# EAGLE design pgacontrol-mini (EAGLE 7.2.0)
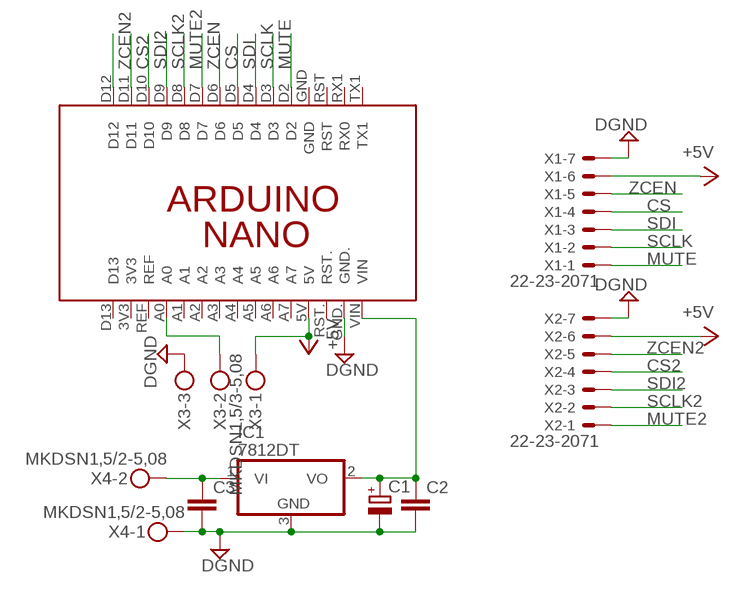
[diagram p0: schematic, sheet 1]

## Parts
C1  CPOL-EUSMCD  [SMC_D]
C2  C-EUC1206  [C1206]
C3  C-EUC1206  [C1206]
IC1  7812DT  [TO252]
PCB1  ARDUINO_NANO  [ARDUINO_NANO]
X1  22-23-2071  [22-23-2071]
X2  22-23-2071  [22-23-2071]
X3  MKDSN1,5/3-5,08  [MKDSN1,5/3-5,08]
X4  MKDSN1,5/2-5,08  [MKDSN1,5/2-5,08]

## Nets
+5V: PCB1.5V X1.6 X2.6 X3.1
CS: PCB1.D5 X1.4
CS2: PCB1.D10 X2.4
DGND: C1.- C2.2 C3.2 IC1.3(GND) PCB1.GND. X1.7 X2.7 X3.3 X4.1
MUTE: PCB1.D2 X1.1
MUTE2: PCB1.D7 X2.1
N$3: PCB1.A0 X3.2
N$10: PCB1.D12
SCLK: PCB1.D3 X1.2
SCLK2: PCB1.D8 X2.2
SDI: PCB1.D4 X1.3
SDI2: PCB1.D9 X2.3
VI: C3.1 IC1.1(VI) X4.2
VO: C1.+ C2.1 IC1.2(VO) PCB1.VIN
ZCEN: PCB1.D6 X1.5
ZCEN2: PCB1.D11 X2.5
Unconnected: PCB1.3V3 PCB1.A1 PCB1.A2 PCB1.A3 PCB1.A4 PCB1.A5 PCB1.A6 PCB1.A7 PCB1.D13 PCB1.GND PCB1.REF PCB1.RST PCB1.RST. PCB1.RX1(RX0) PCB1.TX1

## Library data of the parts
C1 = Vwvwbg:CPOL-EU: POLARIZED CAPACITOR, European symbol
C2 C3 = Vwvwbg:C-EU: CAPACITOR, European symbol
IC1 = adafruit:78*: Positive VOLTAGE REGULATOR Added bigger pads to the TO-92 package
PCB1 = E14_Arduino_revB:ARDUINO_NANO: Device for representing an Arduino Nano board with a footprint in an EAGLE design. Created by Dave Young for Element14. More EAGLE documentation at: http://www.element14.com/community/community/knode/cadsoft_eagle
X1 X2 = con-molex:22-23-2071: .100" (2.54mm) Center Header - 7 Pin; MF: MOLEX; MPN: 22-23-2071; OC_FARNELL: 1654534; OC_NEWARK: 56H0445
X3 = con-phoenix-508:MKDSN1,5/3-5,08: MKDSN 1,5/ 3-5,08 Printklemme Nennstrom: 13,5 A Nennspannung: 250 V Rastermaß: 5,08 mm Polzahl: 3 Anschlussart: Schraubanschluss Montage: Löten Anschlussrichtung Leiter/Platine: 0 ° Artikelnummer: 1729131 Source: http://eshop.phoenixcontact.com .. 1729131.pdf
X4 = con-phoenix-508:MKDSN1,5/2-5,08: MKDSN 1,5/ 2-5,08 Printklemme Nennstrom: 13,5 A Nennspannung: 250 V Rastermaß: 5,08 mm Polzahl: 2 Anschlussart: Schraubanschluss Montage: Löten Anschlussrichtung Leiter/Platine: 0 ° Artikelnummer: 1729128 Source: http://eshop.phoenixcontact.com .. 1729128.pdf

## Board
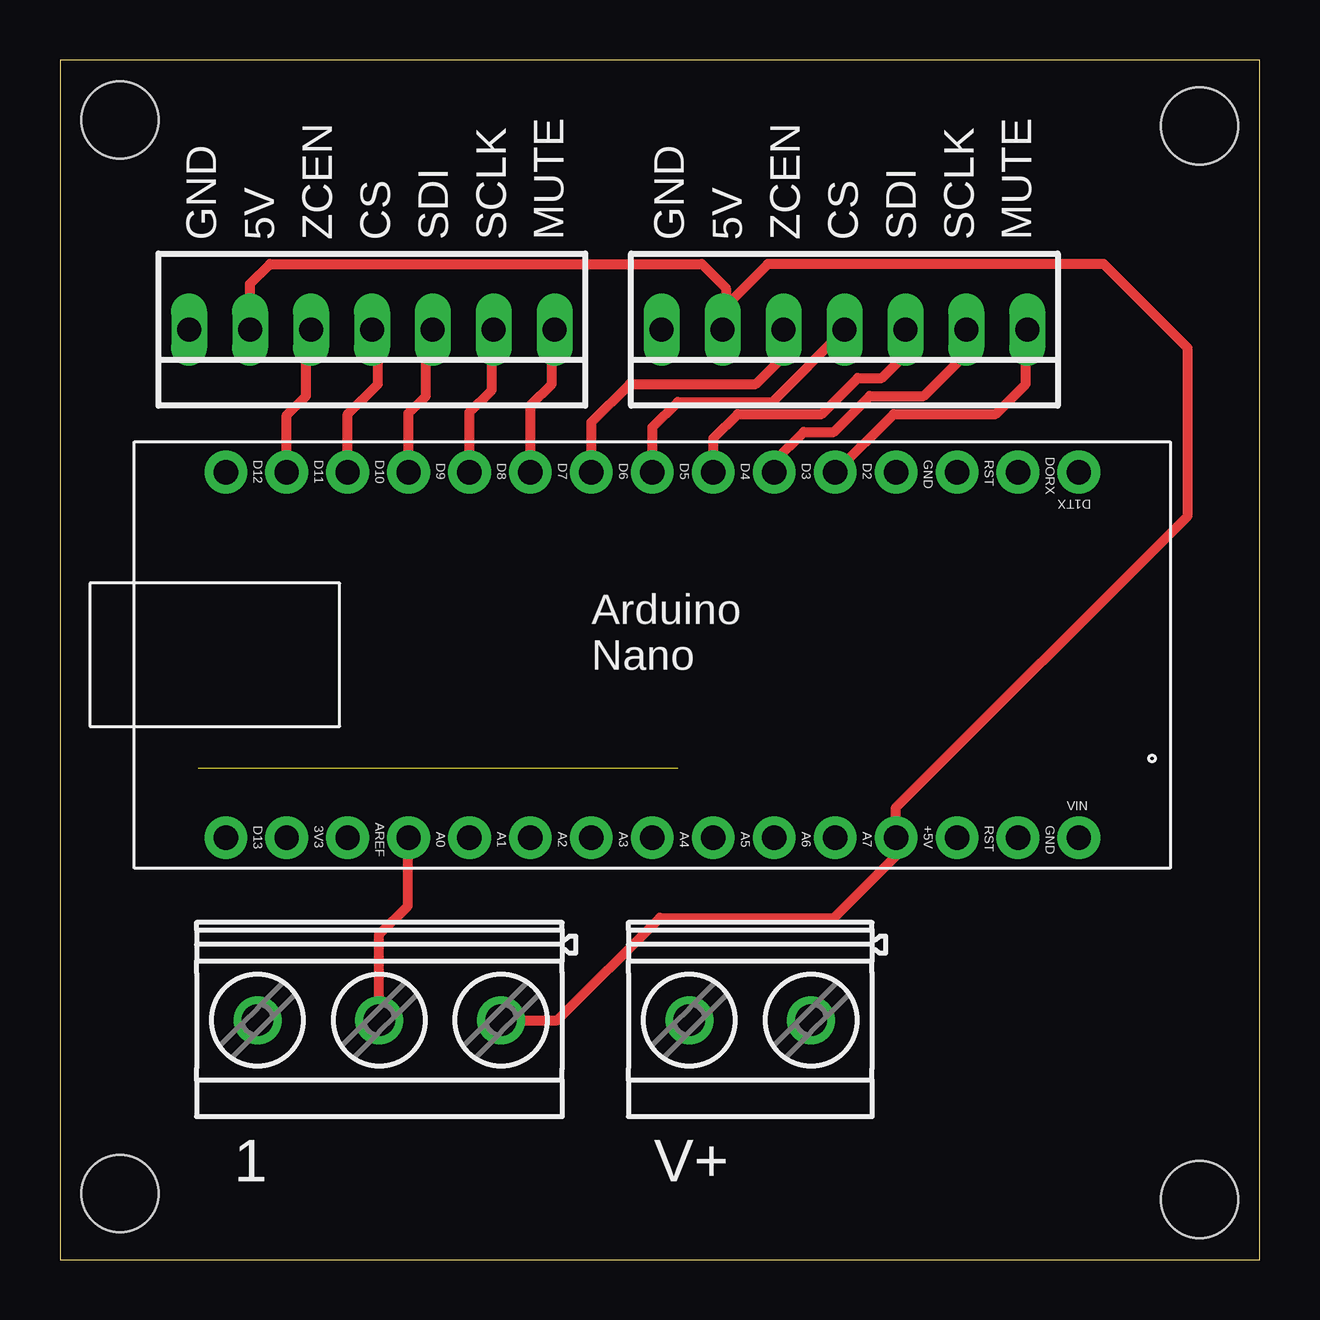
[diagram p1: board, top side]
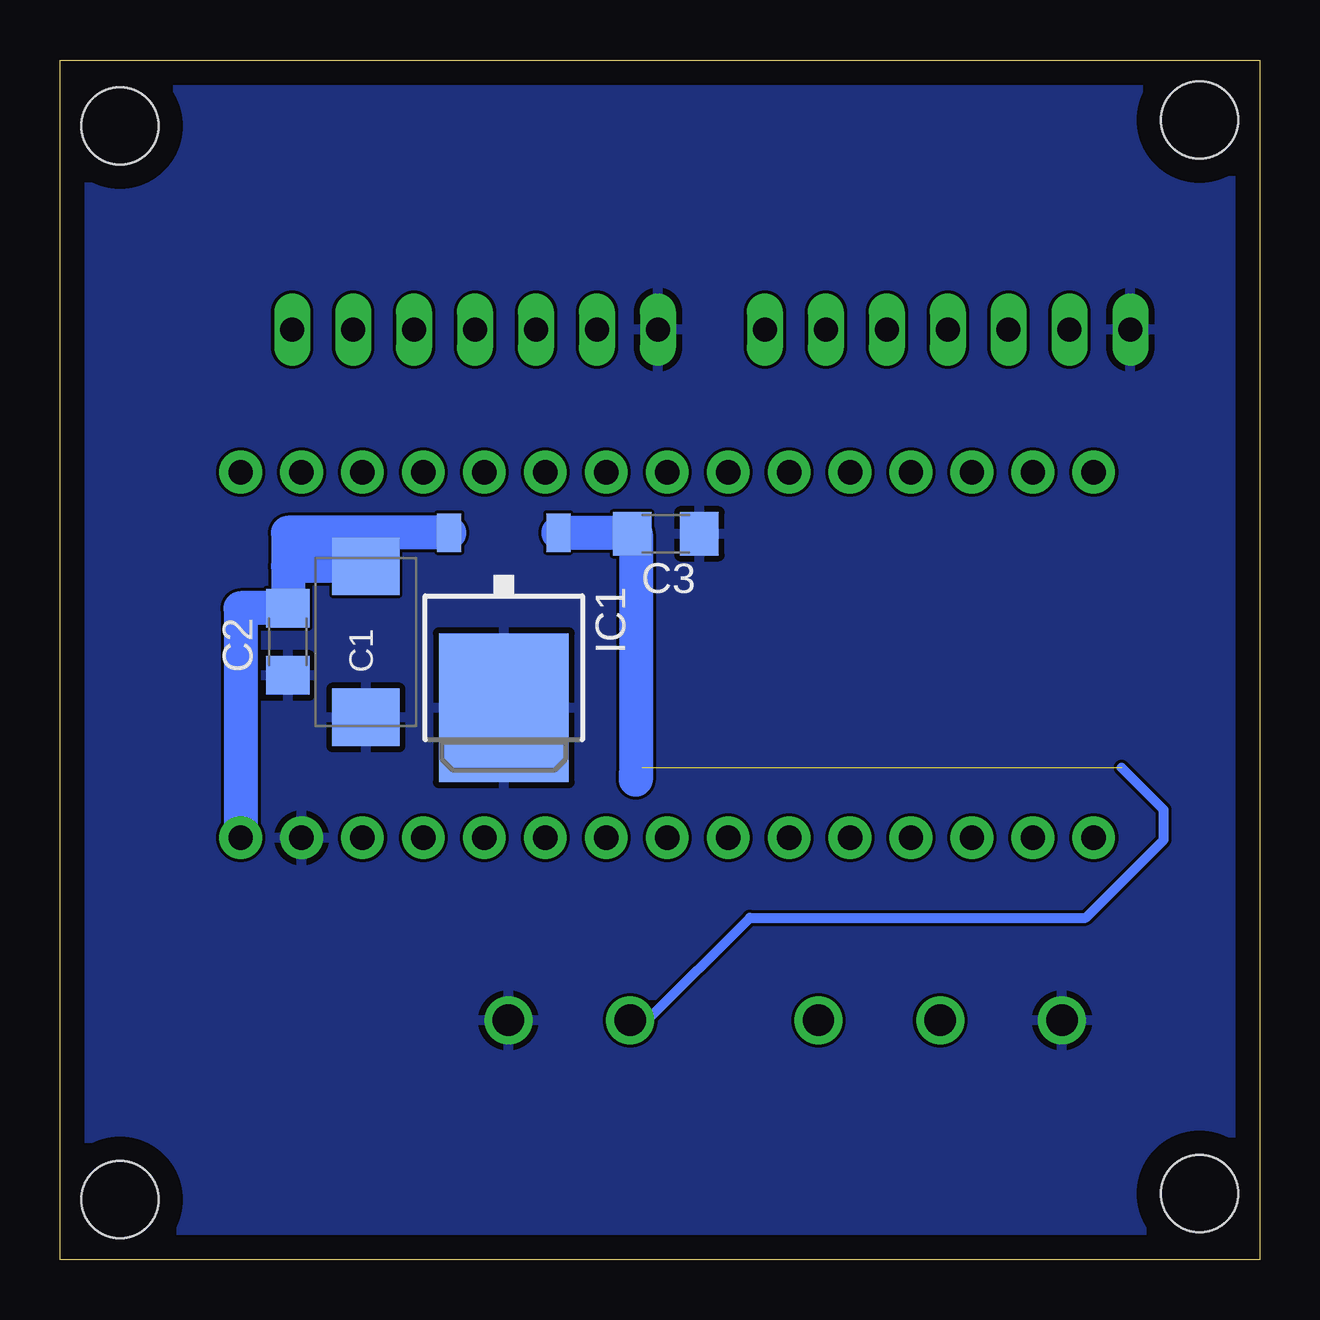
[diagram p2: board, bottom side, seen from below]

Size 50 x 50 mm. Coordinates in mm from the lower left corner, seen from the top.
Outline: 0,0 50,0 50,50 0,50 0,0
Copper layers (1*16): Top 0.035mm / dielectric 1.5mm / Bottom 0.035mm
Design rules "default *": minimum track width 10mil, minimum drill 12mil, track to track 5mil, track to pad 5mil, pad to pad 5mil, via to via 5mil, smd to smd 5mil, copper to edge 40mil, drill to drill 8mil, minimum pad ring 10mil, minimum via ring 8mil, stop-mask expansion 4mil, vias tented up to drill 0mil, thermal gap 10mil
Holes 3.2 mm at 47.5,97.75 2.75,97.5 2.5,47.5 2.5,2.75 47.5,2.5 47.5,47.25

### Footprints (pad centres in the part's own frame; a part is rotated, then mirrored left to right if it is on the bottom)
SMC_D = smd 2.4 x 2.8: + -3.15,0; - 3.15,0
C1206 = smd 1.6 x 1.8: 1 -1.4,0; 2 1.4,0
TO252 = smd 1 x 1.6: 1 -2.28,-4.8; 2 2.28,-4.8 | smd 5.4 x 6.2: 3 0,2.5
ARDUINO_NANO = drill 1.016 pad 1.778: 3V3 6.35,1.27; 5V 31.75,1.27; A0 11.43,1.27; A1 13.97,1.27; A2 16.51,1.27; A3 19.05,1.27; A4 21.59,1.27; A5 24.13,1.27; A6 26.67,1.27; A7 29.21,1.27; D2 29.21,16.51; D3 26.67,16.51; D4 24.13,16.51; D5 21.59,16.51; D6 19.05,16.51; D7 16.51,16.51; D8 13.97,16.51; D9 11.43,16.51; D10 8.89,16.51; D11 6.35,16.51; D12 3.81,16.51; D13 3.81,1.27; GND 31.75,16.51; GND. 36.83,1.27; REF 8.89,1.27; RST 34.29,16.51; RST. 34.29,1.27; RX1 36.83,16.51; TX1 39.37,16.51; VIN 39.37,1.27
22-23-2071 = drill 1 long: 1 -7.62,0; 2 -5.08,0; 3 -2.54,0; 4 0,0; 5 2.54,0; 6 5.08,0; 7 7.62,0
MKDSN1,5/3-5,08 = drill 1.3 pad 2: 1 -7.641,0.025; 2 -2.561,0.025; 3 2.519,0.025
MKDSN1,5/2-5,08 = drill 1.3 pad 2: 1 -2.561,0.025; 2 2.519,0.025

### Placement (x,y rotation side)
C1  37.25,25.75 270 bottom
C2  40.5,25.75 270 bottom
C3  24.75,30.25 0 bottom
IC1  31.5,25.5 180 bottom
PCB1  3.1,16.31 0 top
X1  32.7,38.76 180 top
X2  13,38.76 180 top
X3  10.75,10 180 top
X4  28.75,10 180 top

### Tracks (layer width: path | path; a pad name or v marks a point on that pad's centre or on a via)
+5V
  Top 0.406: X3.1 20.73,9.97 25,14.25 32.25,14.25 35,17 35,17.43 PCB1.5V 34.85,18.85 47,31 47,38 43.5,41.5 29.5,41.5 27.75,39.75 | X2.6 7.92,40.67 8.75,41.5 26.75,41.5 27.75,40.5 27.75,39.75 | 27.75,39.75 27.75,38.89 X1.6
CS
  Top 0.406: PCB1.D5 24.69,34.69 25.75,35.75 29.69,35.75 X1.4
CS2
  Top 0.406: PCB1.D10 11.99,35.24 13.25,36.5 13.25,38.51 X2.4
DGND
  pour Bottom: 0,50.25 50,50 50,0 0,0
MUTE
  Top 0.406: PCB1.D2 34.75,35.25 39,35.25 40.25,36.5 40.25,38.69 X1.1
MUTE2
  Top 0.406: PCB1.D7 19.61,35.61 20.5,36.5 20.5,38.64 X2.1
N$3
  Top 0.406: X3.2 13.31,13.56 14.5,14.75 14.5,17.55 PCB1.A0
SCLK
  Top 0.406: PCB1.D3 29.77,33.27 31,34.5 32.25,34.5 33.75,36 36,36 37.75,37.75 37.75,38.73 X1.2
SCLK2
  Top 0.406: PCB1.D8 17.07,35.32 18,36.25 18,38.68 X2.2
SDI
  Top 0.406: PCB1.D4 27.23,34.23 28.25,35.25 31.75,35.25 33.25,36.75 34.25,36.75 35.25,37.75 X1.3
SDI2
  Top 0.406: PCB1.D9 14.53,35.28 15.25,36 15.25,38.47 X2.3
VI  (1 unrouted)
  Bottom 0.406: X4.2 25.52,9.97 21.25,14.25 7.25,14.25 4,17.5 4,18.75 5.75,20.5 | 25.75,20.5 26,20.25
  Bottom 1.422: IC1.1 26.15,30.3 C3.1 26,30.25 26,20.25 26,20
VO
  Bottom 1.422: IC1.2 40.5,30.3 40.5,28.9 | 40.5,28.9 C2.1 42.47,27.15 PCB1.VIN | C1.+ 40.5,28.9
ZCEN
  Top 0.406: PCB1.D6 22.15,34.9 23.75,36.5 29,36.5 30,37.5 30,38.6 X1.5
ZCEN2
  Top 0.406: PCB1.D11 9.45,35.2 10.25,36 10.25,38.55 X2.5

### Text on the board
tPlace: GND / 5V / ZCEN / CS / SDI / SCLK / MUTE | GND / 5V / ZCEN / CS / SDI / SCLK / MUTE | 1 | V+